# EAGLE schematic schematic (EAGLE 9.7.0)
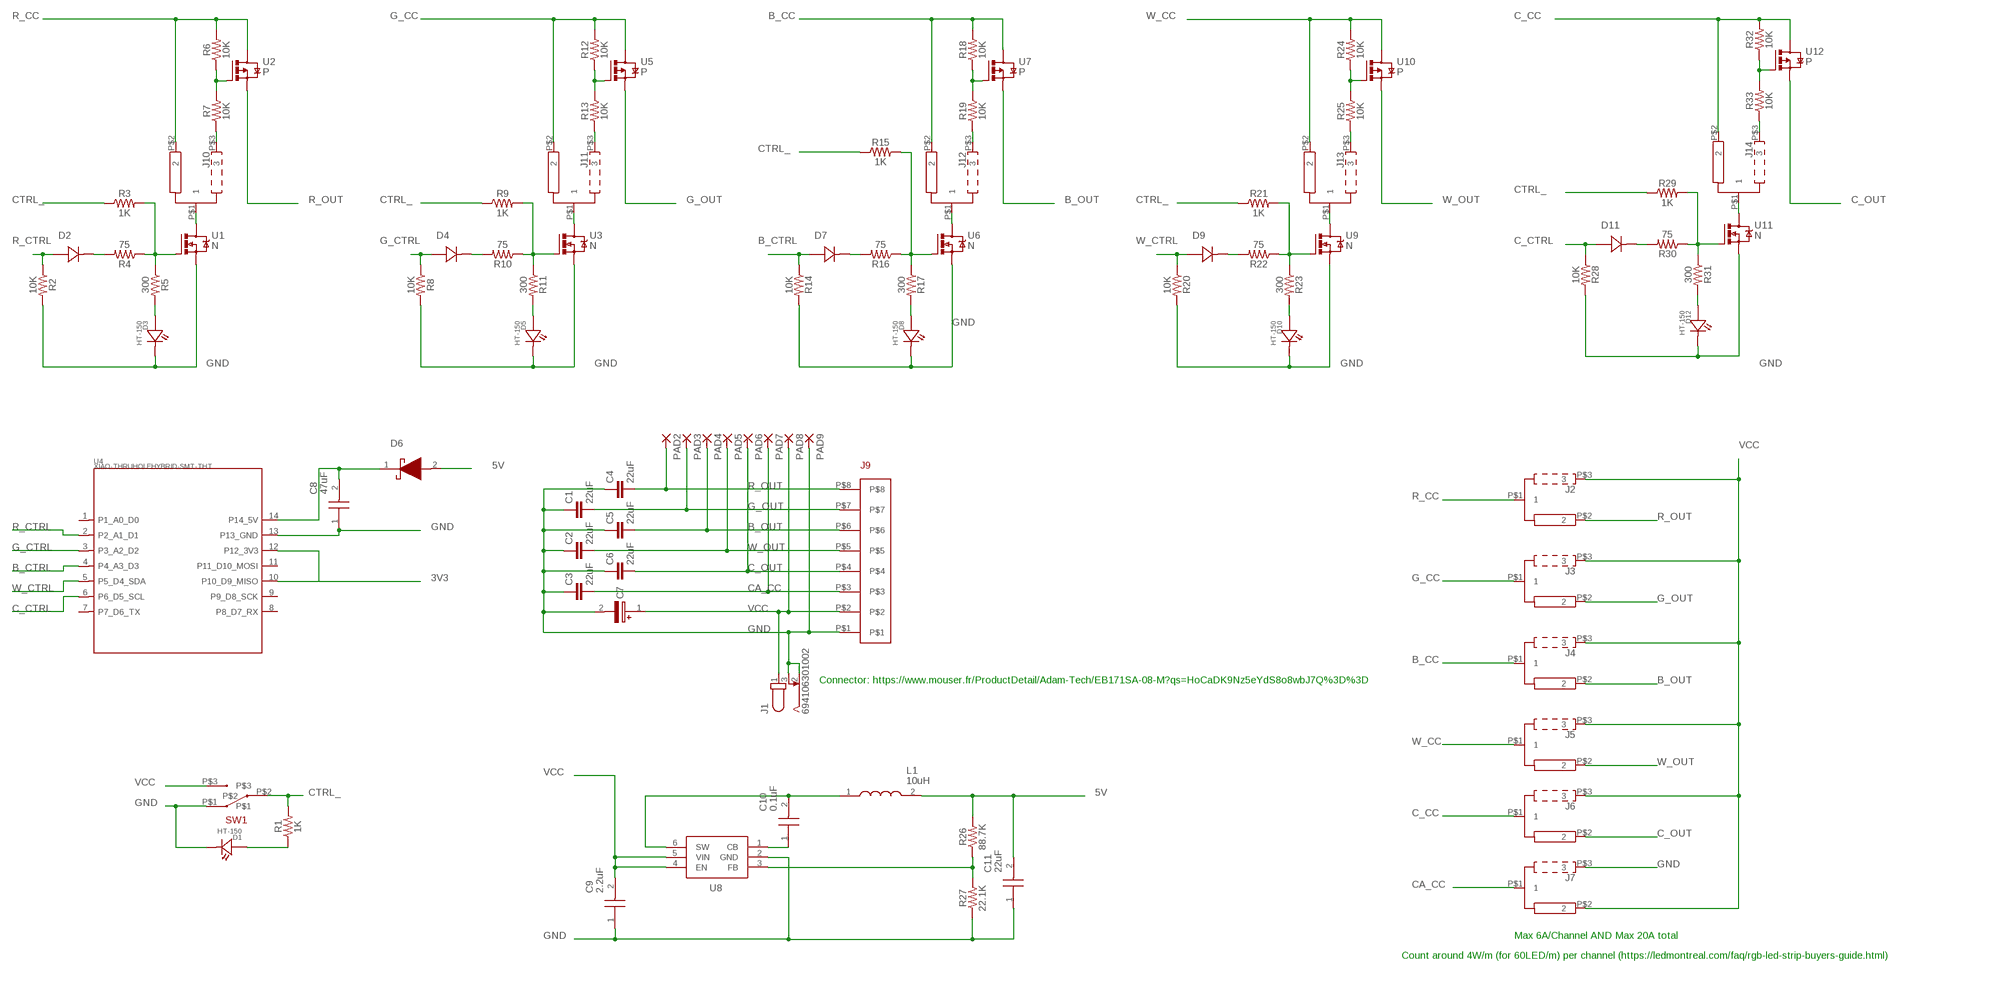
[diagram p0: schematic, sheet 1]

## Parts
C1  22uF  1.0UF-1206-50V-10%  [1206]
C2  22uF  1.0UF-1206-50V-10%  [1206]
C3  22uF  1.0UF-1206-50V-10%  [1206]
C4  22uF  1.0UF-1206-50V-10%  [1206]
C5  22uF  1.0UF-1206-50V-10%  [1206]
C6  22uF  1.0UF-1206-50V-10%  [1206]
C7  35TRV100M8X10.5  [CAPAE830X1050N]
C8  47uF  CL31A226KAHNNNE  [CAPC3216X180N]
C9  2.2uF  CL31A226KAHNNNE  [CAPC3216X180N]
C10  0.1uF  CL31A226KAHNNNE  [CAPC3216X180N]
C11  22uF  CL31A226KAHNNNE  [CAPC3216X180N]
D1  HT-150  [1206-LED]
D2  CUS520,H3FUSC_TOS  [USC_TOS]
D3  HT-150  [1206-LED]
D4  CUS520,H3FUSC_TOS  [USC_TOS]
D5  HT-150  [1206-LED]
D6  1N5819HW1-7-F  [SODFL3518X115N]
D7  CUS520,H3FUSC_TOS  [USC_TOS]
D8  HT-150  [1206-LED]
D9  CUS520,H3FUSC_TOS  [USC_TOS]
D10  HT-150  [1206-LED]
D11  CUS520,H3FUSC_TOS  [USC_TOS]
D12  HT-150  [1206-LED]
J1  694106301002  [694106301002]
J2  5102-2  [5102-2]
J3  5102-2  [5102-2]
J4  5102-2  [5102-2]
J5  5102-2  [5102-2]
J6  5102-2  [5102-2]
J7  5102-2  [5102-2]
J9  EB171SA-08-M  [EB171SA-08-M]
J10  5102-2  [5102-2]
J11  5102-2  [5102-2]
J12  5102-2  [5102-2]
J13  5102-2  [5102-2]
J14  5102-2  [5102-2]
L1  10uH  AOTA-B252010S100MT  [INDC2520X100N]
PAD2  1,6/0,8  [1,6/0,8]
PAD3  1,6/0,8  [1,6/0,8]
PAD4  1,6/0,8  [1,6/0,8]
PAD5  1,6/0,8  [1,6/0,8]
PAD6  1,6/0,8  [1,6/0,8]
PAD7  1,6/0,8  [1,6/0,8]
PAD8  1,6/0,8  [1,6/0,8]
PAD9  1,6/0,8  [1,6/0,8]
R1  1K  10OHM-1206-1/4W-1%  [1206]
R2  10K  10OHM-1206-1/4W-1%  [1206]
R3  1K  10OHM-1206-1/4W-1%  [1206]
R4  75  10OHM-1206-1/4W-1%  [1206]
R5  300  10OHM-1206-1/4W-1%  [1206]
R6  10K  10OHM-1206-1/4W-1%  [1206]
R7  10K  10OHM-1206-1/4W-1%  [1206]
R8  10K  10OHM-1206-1/4W-1%  [1206]
R9  1K  10OHM-1206-1/4W-1%  [1206]
R10  75  10OHM-1206-1/4W-1%  [1206]
R11  300  10OHM-1206-1/4W-1%  [1206]
R12  10K  10OHM-1206-1/4W-1%  [1206]
R13  10K  10OHM-1206-1/4W-1%  [1206]
R14  10K  10OHM-1206-1/4W-1%  [1206]
R15  1K  10OHM-1206-1/4W-1%  [1206]
R16  75  10OHM-1206-1/4W-1%  [1206]
R17  300  10OHM-1206-1/4W-1%  [1206]
R18  10K  10OHM-1206-1/4W-1%  [1206]
R19  10K  10OHM-1206-1/4W-1%  [1206]
R20  10K  10OHM-1206-1/4W-1%  [1206]
R21  1K  10OHM-1206-1/4W-1%  [1206]
R22  75  10OHM-1206-1/4W-1%  [1206]
R23  300  10OHM-1206-1/4W-1%  [1206]
R24  10K  10OHM-1206-1/4W-1%  [1206]
R25  10K  10OHM-1206-1/4W-1%  [1206]
R26  88.7K  10OHM-1206-1/4W-1%  [1206]
R27  22.1K  10OHM-1206-1/4W-1%  [1206]
R28  10K  10OHM-1206-1/4W-1%  [1206]
R29  1K  10OHM-1206-1/4W-1%  [1206]
R30  75  10OHM-1206-1/4W-1%  [1206]
R31  300  10OHM-1206-1/4W-1%  [1206]
R32  10K  10OHM-1206-1/4W-1%  [1206]
R33  10K  10OHM-1206-1/4W-1%  [1206]
SW1  SLW-129956-4A-RA-N-D  [SLW-129956-4A-RA-N-D]
U1  N  DMG4496SSS-13-NMOS  [SOIC127P600X175-8N]
U2  P  DMP3036SSS-13-PMOS  [SOIC127P600X170-8N]
U3  N  DMG4496SSS-13-NMOS  [SOIC127P600X175-8N]
U4  XIAO-THRUHOLEHYBRID-SMT-THT  [XIAO-GENERIC-HYBRID-MODULE14P-2.54-21X17.8MM]
U5  P  DMP3036SSS-13-PMOS  [SOIC127P600X170-8N]
U6  N  DMG4496SSS-13-NMOS  [SOIC127P600X175-8N]
U7  P  DMP3036SSS-13-PMOS  [SOIC127P600X170-8N]
U8  TPS560430XFDBVR  [SOT95P280X145-6N]
U9  N  DMG4496SSS-13-NMOS  [SOIC127P600X175-8N]
U10  P  DMP3036SSS-13-PMOS  [SOIC127P600X170-8N]
U11  N  DMG4496SSS-13-NMOS  [SOIC127P600X175-8N]
U12  P  DMP3036SSS-13-PMOS  [SOIC127P600X170-8N]

## Nets
3V3: U4.12(P12_3V3)
5V: C11.2 D6.2(A) L1.2 R26.2
B_CC [6A]: J4.P$1 J12.P$2 R18.2 U7.5(D) U7.6(D) U7.7(D) U7.8(D)
B_CTRL: D7.2(ANODE) R14.1 U4.4(P4_A3_D3)
B_OUT [6A]: C5.2 J4.P$2 J9.P$6 PAD4.1(P) U7.1(S) U7.2(S) U7.3(S)
C_CC [6A]: J6.P$1 J14.P$2 R32.2 U12.5(D) U12.6(D) U12.7(D) U12.8(D)
C_CTRL: D11.2(ANODE) R28.1 U4.6(P6_D5_SCL)
C_OUT [6A]: C6.2 J6.P$2 J9.P$4 PAD6.1(P) U12.1(S) U12.2(S) U12.3(S)
CA_CC [20A]: C3.2 J7.P$1 J9.P$3 PAD7.1(P)
CTRL_: R1.2 R3.1 R9.1 R15.1 R21.1 R29.1 SW1.P$2
G_CC [6A]: J3.P$1 J11.P$2 R12.2 U5.5(D) U5.6(D) U5.7(D) U5.8(D)
G_CTRL: D4.2(ANODE) R8.1 U4.3(P3_A2_D2)
G_OUT [6A]: C1.2 J3.P$2 J9.P$7 PAD3.1(P) U5.1(S) U5.2(S) U5.3(S)
GND [20A]: C1.1 C2.1 C3.1 C4.1 C5.1 C6.1 C7.2(-) C8.1 C9.1 C11.1 D1.P$2(CATHODE) D3.P$2(CATHODE) D5.P$2(CATHODE) D8.P$2(CATHODE) D10.P$2(CATHODE) D12.P$2(CATHODE) J1.2 J1.3 J7.P$3 J9.P$1 PAD9.1(P) R2.2 R8.2 R14.2 R20.2 R27.1 R28.2 SW1.P$1 U1.1(S) U1.2(S) U1.3(S) U3.1(S) U3.2(S) U3.3(S) U4.13(P13_GND) U6.1(S) U6.2(S) U6.3(S) U8.2(GND) U9.1(S) U9.2(S) U9.3(S) U11.1(S) U11.2(S) U11.3(S)
N$1: U4.10(P10_D9_MISO)
N$2: C10.2 L1.1 U8.6(SW)
N$3 [6A]: J13.P$1 U9.5(D) U9.6(D) U9.7(D) U9.8(D)
N$4: J13.P$3 R25.1
N$5: D1.P$1(ANODE) R1.1
N$6: R24.1 R25.2 U10.4(G)
N$7 [6A]: J12.P$1 U6.5(D) U6.6(D) U6.7(D) U6.8(D)
N$8: J12.P$3 R19.1
N$9: R18.1 R19.2 U7.4(G)
N$10: D3.P$1(ANODE) R5.2
N$11 [6A]: J10.P$1 U1.5(D) U1.6(D) U1.7(D) U1.8(D)
N$12: R6.1 R7.2 U2.4(G)
N$13: J10.P$3 R7.1
N$14: D5.P$1(ANODE) R11.2
N$15 [6A]: J11.P$1 U3.5(D) U3.6(D) U3.7(D) U3.8(D)
N$16: R12.1 R13.2 U5.4(G)
N$17: J11.P$3 R13.1
N$18: D8.P$1(ANODE) R17.2
N$20: R9.2 R10.1 R11.1 U3.4(G)
N$21: R15.2 R16.1 R17.1 U6.4(G)
N$22: R21.2 R22.1 R23.1 U9.4(G)
N$23: R3.2 R4.1 R5.1 U1.4(G)
N$24 [6A]: J14.P$1 U11.5(D) U11.6(D) U11.7(D) U11.8(D)
N$25: R32.1 R33.2 U12.4(G)
N$26: R29.2 R30.1 R31.1 U11.4(G)
N$27: D11.1(CATHODE) R30.2
N$28: J14.P$3 R33.1
N$29: C10.1 U8.1(CB)
N$30: R26.1 R27.2 U8.3(FB)
N$31: D9.1(CATHODE) R22.2
N$32: D10.P$1(ANODE) R23.2
N$33: D2.1(CATHODE) R4.2
N$34: D12.P$1(ANODE) R31.2
N$35: D4.1(CATHODE) R10.2
N$36: D7.1(CATHODE) R16.2
N$37: C8.2 D6.1(K) U4.14(P14_5V)
R_CC [6A]: J2.P$1 J10.P$2 R6.2 U2.5(D) U2.6(D) U2.7(D) U2.8(D)
R_CTRL: D2.2(ANODE) R2.1 U4.2(P2_A1_D1)
R_OUT [6A]: C4.2 J2.P$2 J9.P$8 PAD2.1(P) U2.1(S) U2.2(S) U2.3(S)
VCC [6A]: C7.1(+) C9.2 J1.1 J2.P$3 J3.P$3 J4.P$3 J5.P$3 J6.P$3 J7.P$2 J9.P$2 PAD8.1(P) SW1.P$3 U8.4(EN) U8.5(VIN)
W_CC [6A]: J5.P$1 J13.P$2 R24.2 U10.5(D) U10.6(D) U10.7(D) U10.8(D)
W_CTRL: D9.2(ANODE) R20.1 U4.5(P5_D4_SDA)
W_OUT [6A]: C2.2 J5.P$2 J9.P$5 PAD5.1(P) U10.1(S) U10.2(S) U10.3(S)
Unconnected: U4.1(P1_A0_D0) U4.7(P7_D6_TX) U4.8(P8_D7_RX) U4.9(P9_D8_SCK) U4.11(P11_D10_MOSI)

## Notes on the sheet
- Connector: https://www.mouser.fr/ProductDetail/Adam-Tech/EB171SA-08-M?qs=HoCaDK9Nz5eYdS8o8wbJ7Q%3D%3D
- Max 6A/Channel AND Max 20A total
- Count around 4W/m (for 60LED/m) per channel (https://ledmontreal.com/faq/rgb-led-strip-buyers-guide.html)

## Library data of the parts
C1-C6 = SparkFun-Capacitors:1.0UF: 1µF ceramic capacitors A capacitor is a passive two-terminal electrical component used to store electrical energy temporarily in an electric field.; PROD_ID: CAP-09822; VALUE: 1.0uF
C7 = project_lib:35TRV100M8X10.5: RUBYCON - 35TRV100M8X10.5 - SMD Aluminium Electrolytic Capacitor, Radial Can, 100 F, 35 V, 0.15 ohm, TRV Series Source: Datasheet <http://www.rubycon.co.jp/en/catalog/e_pdfs/aluminum/e_TRV.pdf>; DESCRIPTION: RUBYCON - 35TRV100M8X10.5 - SMD Aluminium Electrolytic Capacitor, Radial Can, 100 F, 35 V, 0.15 ohm, TRV Series; HEIGHT: 10.5mm; MANUFACTURER_NAME: Rubycon; MANUFACTURER_PART_NUMBER: 35TRV100M8X10.5; MOUSER_PART_NUMBER: 232-35TRV100M8X10.5; MOUSER_PRICE-STOCK: https://www.mouser.co.uk/ProductDetail/Rubycon/35TRV100M8X105?qs=T3oQrply3y96cRA8S4HJ9A%3D%3D
C8-C11 = CL31A226KAHNNNE:CL31A226KAHNNNE: SAMSUNG ELECTRO-MECHANICS - CL31A226KAHNNNE - CAP, 22UF, 25V, MLCC, 1206 Source: Datasheet <https://datasheet.datasheetarchive.com/originals/distributors/Datasheets_SAMA/9f57e07966b0fde480de744eca033cf5.pdf>; DESCRIPTION: SAMSUNG ELECTRO-MECHANICS - CL31A226KAHNNNE - CAP, 22UF, 25V, MLCC, 1206; HEIGHT: 1.8mm; MANUFACTURER_NAME: SAMSUNG; MANUFACTURER_PART_NUMBER: CL31A226KAHNNNE; MOUSER_PART_NUMBER: 187-CL31A226KAHNNNE; MOUSER_PRICE-STOCK: https://www.mouser.co.uk/ProductDetail/Samsung-Electro-Mechanics/CL31A226KAHNNNE?qs=X6jEic%2FHinCdwsjGJII51w%3D%3D
D1 D3 D5 D8 D10 D12 = project_lib:HT-150: HT-150 Harvatech led serie: https://www.digikey.fr/fr/products/detail/harvatek-corporation/HT-150UYG-5307/24635251
D2 D4 D7 D9 D11 = project_lib:CUS520,H3F: https://www.digikey.fr/fr/products/detail/toshiba-semiconductor-and-storage/CUS520-H3F/5114303; COPYRIGHT: Copyright (C) 2024 Ultra Librarian. All rights reserved.; MANUFACTURER_PART_NUMBER: CUS520,H3F; MFR_NAME: Toshiba Electronic Devices & Storage Corp.
D6 = 1N5819HW1-7-F:1N5819HW1-7-F: 1N5819 Schottky Diode 40V 1A SOD123F Source: Datasheet <https://www.diodes.com//assets/Datasheets/1N5819HW1.pdf>; DESCRIPTION: 1N5819 Schottky Diode 40V 1A SOD123F; HEIGHT: 1.15mm; MANUFACTURER_NAME: Diodes Incorporated; MANUFACTURER_PART_NUMBER: 1N5819HW1-7-F; MOUSER_PART_NUMBER: 621-1N5819HW1-7-F; MOUSER_PRICE-STOCK: https://www.mouser.co.uk/ProductDetail/Diodes-Incorporated/1N5819HW1-7-F?qs=60RJRzIpcl9ACQG7Zn63jQ%3D%3D
J1 = DC Power Jacks:694106301002: CONN PWR JACK 2.1X5.5MM SOLDER Manufacturer's datasheet <https://katalog.we-online.de/em/datasheet/6941xx301002.pdf>; CREATED_BY: PCBLayout.com; DIGIKEY_PART_NUMBER: 732-5930-ND; MANUFACTURER: Wurth Electronics Inc.; MPN: 694106301002
J2-J7 J10-J14 = project_lib:5102-2: Circuit Board Hardware - PCB JUMPER KEYSTONE 5102 (20A) https://eu.mouser.com/ProductDetail/Keystone-Electronics/5102?qs=SKxV22VtNmcgs0g1AJCdFg%3D%3D
J9 = project_lib:EB171SA-08-M
L1 = AOTA-B252010S100MT:AOTA-B252010S100MT: IND 10uH 1.2A 420 Source: Datasheet <https://abracon.com/datasheets/AOTA-B252010S.pdf>; DESCRIPTION: IND 10uH 1.2A 420; HEIGHT: 1mm; MANUFACTURER_NAME: ABRACON; MANUFACTURER_PART_NUMBER: AOTA-B252010S100MT; MOUSER_PART_NUMBER: 815-AOTB252010S100MT; MOUSER_PRICE-STOCK: https://www.mouser.co.uk/ProductDetail/ABRACON/AOTA-B252010S100MT?qs=1Kr7Jg1SGW80mVrWNV0NfQ%3D%3D
PAD2-PAD9 = wirepad:1,6/0,8: THROUGH-HOLE PAD
R1-R33 = SparkFun-Resistors:10OHM: 10Ω resistor A resistor is a passive two-terminal electrical component that implements electrical resistance as a circuit element. Resistors act to reduce current flow, and, at the same time, act to lower voltage levels within circuits. - Wikipedia; PROD_ID: RES-08705; VALUE: 10
SW1 = project_lib:SLW-129956-4A-RA-N-D: Commutateurs à glissière 12.9 x 9 x 5.6 mm, 4 mm Raised Slide Actuator, Right Angle, Through Hole. https://www.mouser.fr/ProductDetail/CUI-Devices/SLW-129956-4A-RA-N-D?qs=IKkN%2F947nfAoCoaoyLYE3A%3D%3D
U1 U3 U6 U9 U11 = project_lib:DMG4496SSS-13-NMOS: Diodes Inc DMG4496SSS-13 N-channel MOSFET Transistor, 10 A, 30 V, 8-Pin SOIC Source: Datasheet <https://www.diodes.com//assets/Datasheets/ds32048.pdf>; DESCRIPTION: Diodes Inc DMG4496SSS-13 N-channel MOSFET Transistor, 10 A, 30 V, 8-Pin SOIC; HEIGHT: 1.75mm; MANUFACTURER_NAME: Diodes Incorporated; MANUFACTURER_PART_NUMBER: DMG4496SSS-13; MOUSER_PART_NUMBER: 621-DMG4496SSS-13; MOUSER_PRICE-STOCK: https://www.mouser.co.uk/ProductDetail/Diodes-Incorporated/DMG4496SSS-13?qs=TdAo5oSZJZPQGA%2FSpG2w%252BA%3D%3D
U2 U5 U7 U10 U12 = project_lib:DMP3036SSS-13-PMOS: Trans MOSFET P-CH 30V 19.5A 8-Pin SO T/R Source: Datasheet <https://www.diodes.com//assets/Datasheets/DMP3036SSS.pdf>; DESCRIPTION: Trans MOSFET P-CH 30V 19.5A 8-Pin SO T/R; HEIGHT: 1.7mm; MANUFACTURER_NAME: Diodes Incorporated; MANUFACTURER_PART_NUMBER: DMP3036SSS-13; MOUSER_PART_NUMBER: 621-DMP3036SSS-13; MOUSER_PRICE-STOCK: https://www.mouser.co.uk/ProductDetail/Diodes-Incorporated/DMP3036SSS-13?qs=OVC8WVYZliRZKy3PQFLfog%3D%3D
U4 = Seeed Studio XIAO Series:XIAO-THRUHOLE: Seeed Studio XIAO Series Through-hole Footprint and Symbol Basic through-hole footprint for Seeed XIAO series of boards. The underside surface mount pads are disabled. For through-hole mounting, a pair of 7-pin, 2.54mm pitch headers with 0.64x0.64mm square leads are recommended. The hybrid variant allows the assembler to choose between surface mount and through-hole mounting methods. However, there is a risk of solder leakage and therefore insufficient solder at the joints if soldering using solder paste and stencils, so we advise using this footprint only when the module is intended to be hand soldered. The symbol pin labels are generic. Please refer to the specific board for more information. Seeed Studio XIAO SAMD21 (Seeeduino XIAO) is also available pre-soldered: Seeed Studio XIAO SAMD21 Pre-soldered - Microchip ATSAMD21G18 Arduino Microcontroller with headers Seeed SKU: 102010388 Buy now <https://www.seeedstudio.com/Seeeduino-XIAO-Pre-Soldered-p-4747.html>
U8 = project_lib:TPS560430XFDBVR: Switching Voltage Regulators SIMPLE SWITCHER 36-V, 600-mA Buck Regulator With High-Efficiency Sleep Mode 6-SOT-23 -40 to 125 Source: Datasheet <http://www.ti.com/lit/ds/symlink/tps560430.pdf>; DESCRIPTION: Switching Voltage Regulators SIMPLE SWITCHER 36-V, 600-mA Buck Regulator With High-Efficiency Sleep Mode 6-SOT-23 -40 to 125; HEIGHT: 1.45mm; MANUFACTURER_NAME: Texas Instruments; MANUFACTURER_PART_NUMBER: TPS560430XFDBVR; MOUSER_PART_NUMBER: 595-TPS560430XFDBVR; MOUSER_PRICE-STOCK: https://www.mouser.co.uk/ProductDetail/Texas-Instruments/TPS560430XFDBVR?qs=y6ZabgHbY%252BykP8hTjJnvcA%3D%3D